# EAGLE design design1 (EAGLE 9.5.1)
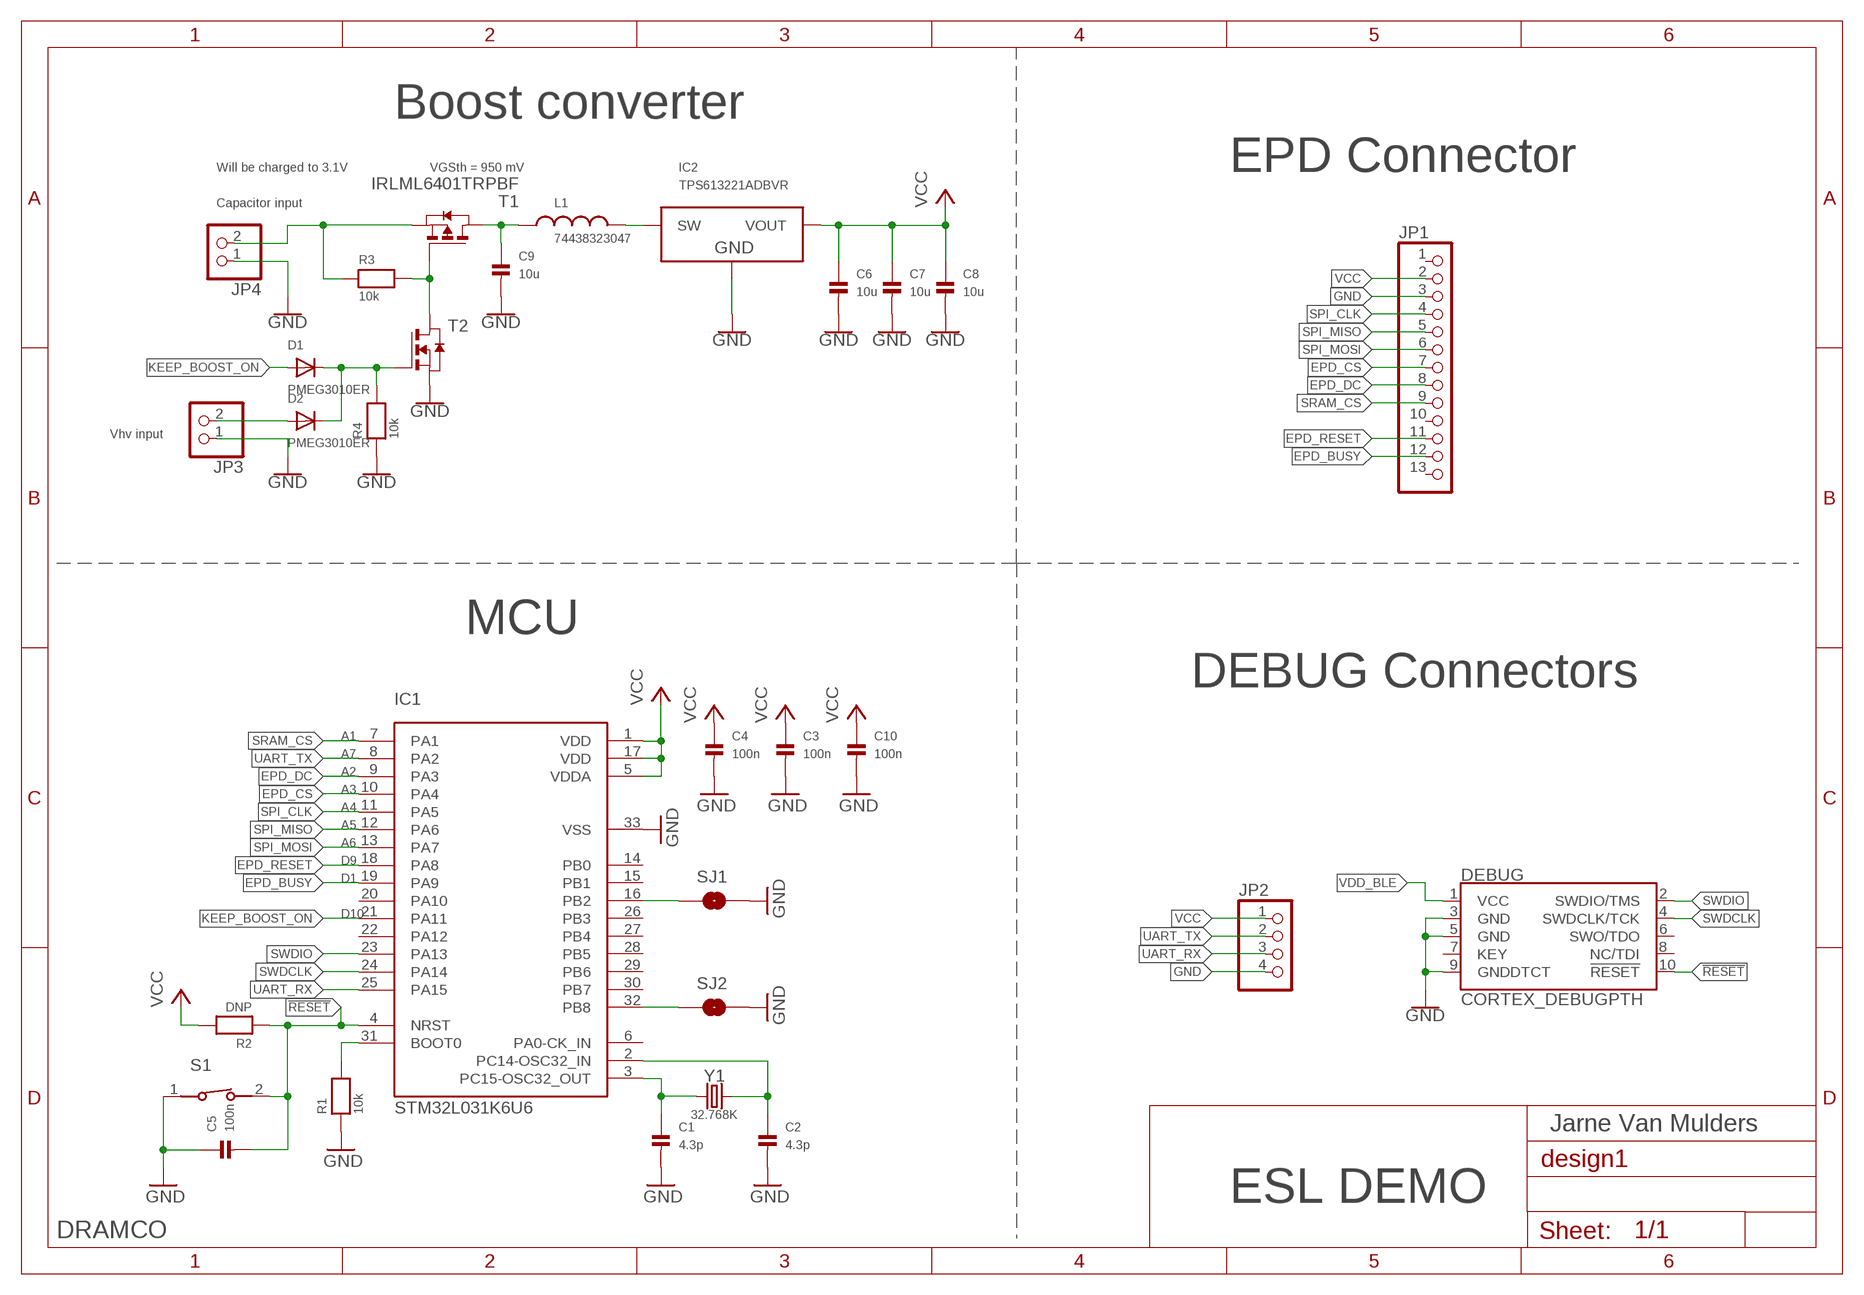
[diagram p0: schematic, sheet 1]

## Parts
C1  4.3p  CAP_CERAMIC0603  [0603]
C2  4.3p  CAP_CERAMIC0603  [0603]
C3  100n  CAP_CERAMIC0603  [0603]
C4  100n  CAP_CERAMIC0603  [0603]
C5  100n  CAP_CERAMIC0603  [0603]
C6  10u  CAP_CERAMIC0805  [0805]
C7  10u  CAP_CERAMIC0805  [0805]
C8  10u  CAP_CERAMIC0805  [0805]
C9  10u  CAP_CERAMIC0805  [0805]
C10  100n  CAP_CERAMIC0603  [0603]
D1  PMEG3010ER  DIODESOD-323  [SOD-323]
D2  PMEG3010ER  DIODESOD-323  [SOD-323]
DEBUG  CORTEX_DEBUGPTH  [2X5-PTH-1.27MM]
IC1  STM32L031K6U6  [UFQFPN32]
IC2  TPS61322XX  [SOT95P280X145-5N]
JP1  HEADER-1X13  [1X13_ROUND_70]
JP2  HEADER-1X4ROUND  [1X04_ROUND]
JP3  HEADER-1X2ROUND  [1X02_ROUND]
JP4  HEADER-1X2ROUND  [1X02_ROUND]
L1  74438323047  WE-MAPI_2510_74438323047  [WE-MAIA_2510]
R1  10k  RESISTOR0603  [0603]
R2  DNP  RESISTOR0603  [0603]
R3  10k  RESISTOR0603  [0603]
R4  10k  RESISTOR0603  [0603]
S1  434111043826  [434111043826]
SJ1  SOLDERJUMPERNO  [SJ_2S-NO]
SJ2  SOLDERJUMPERNO  [SJ_2S-NO]
T1  IRLML6401TRPBF  PMOSSOT23  [SOT-23]
T2  NMOSSOT23  [SOT-23]
Y1  32.768K  CRYSTALSMD-3.2X1.5  [CRYSTAL-SMD-3.2X1.5MM]

## Nets
!RESET!: C5.2 DEBUG.10(!RESET) IC1.4(NRST) R2.1 S1.2
EPD_BUSY: IC1.19(PA9) JP1.12
EPD_CS: IC1.10(PA4) JP1.7
EPD_DC: IC1.9(PA3) JP1.8
EPD_RESET: IC1.18(PA8) JP1.11
GND: C1.2 C2.2 C3.2 C4.2 C5.1 C6.2 C7.2 C8.2 C9.2 C10.2 DEBUG.3(GND) DEBUG.5(GND) DEBUG.9(GNDDTCT) IC1.33(VSS) IC2.2(GND) JP1.3 JP2.4 JP3.1 JP4.1 R1.1 R4.1 S1.1 SJ1.2 SJ2.2 T2.2(S)
KEEP_BOOST_ON: D1.A IC1.21(PA11)
N$1: IC1.31(BOOT0) R1.2
N$2: C2.1 IC1.2(PC14-OSC32_IN) Y1.P$2
N$3: C1.1 IC1.3(PC15-OSC32_OUT) Y1.P$1
N$4: IC1.16(PB2) SJ1.1
N$5: IC1.32(PB8) SJ2.1
N$6: C9.1 L1.1 T1.1(D)
N$7: IC2.1(SW) L1.2
N$9: D1.C D2.C R4.2 T2.3(G)
N$10: R3.2 T1.3(G) T2.1(D)
N$11: JP4.2 R3.1 T1.2(S)
N$12: D2.A JP3.2
SPI_CLK: IC1.11(PA5) JP1.4
SPI_MISO: IC1.12(PA6) JP1.5
SPI_MOSI: IC1.13(PA7) JP1.6
SRAM_CS: IC1.7(PA1) JP1.9
SWDCLK: DEBUG.4(SWDCLK/TCK) IC1.24(PA14)
SWDIO: DEBUG.2(SWDIO/TMS) IC1.23(PA13)
UART_RX: IC1.25(PA15) JP2.3
UART_TX: IC1.8(PA2) JP2.2
VCC: C3.1 C4.1 C6.1 C7.1 C8.1 C10.1 IC1.1(VDD) IC1.5(VDDA) IC1.17(VDD) IC2.4(VOUT) JP1.2 JP2.1 R2.2
VDD_BLE: DEBUG.1(VCC)
Unconnected: DEBUG.6(SWO/TDO) DEBUG.7(KEY) DEBUG.8(NC/TDI) IC1.6(PA0-CK_IN) IC1.14(PB0) IC1.15(PB1) IC1.20(PA10) IC1.22(PA12) IC1.26(PB3) IC1.27(PB4) IC1.28(PB5) IC1.29(PB6) IC1.30(PB7) JP1.1 JP1.10 JP1.13

## Notes on the sheet
- Boost converter
- Will be charged to 3.1V | VGSth = 950 mV | EPD Connector
- TPS613221ADBVR
- Capacitor input
- Vhv input
- MCU
- DEBUG Connectors
- A1
- A7
- A2
- A3
- A4
- A5
- A6
- D9
- D1
- D10
- Jarne Van Mulders
- ESL DEMO
- DRAMCO

## Library data of the parts
C1-C10 = microbuilder:CAP_CERAMIC: Ceramic Capacitors 0402 - 0402 Surface Mount Capacitors 16pF 50V 5% [Digikey: 445-4899-2-ND] 18pF 50V 5% [Digikey: 490-1281-2-ND] 22pF 50V 5% [Digikey: 490-1283-2-ND] 68pF 50V 5% [Digikey: 490-1289-2-ND] 0.1uF 10V 10% [Digikey: 490-1318-2-ND] 1.0uF 6.3V 10% [Digikey: 490-1320-2-ND] 0603 - 0603 Surface Mount Capacitors 16 pF 50V 5% [Digikey: 445-5051-2-ND] 22 pF 50V [Digikey: PCC220ACVTR-ND] 33 pF 50V 5% [Digikey: 490-1415-1-ND] 56pF 50V 5% [Digikey: 490-1421-1-ND] 220pF 50V 5% [Digikey: 445-1285-1-ND] 680 pF 50V 2200 pF 50V 5% C0G [Digikey: 445-1297-1-ND] 5600 pF 100V 5% X7R [Digikey: 478-3711-1-ND] 0.1 µF 25V 10% [Digikey: PCC2277TR-ND] 0.22 µF 16V 10% X7R [Digikey: 445-1318-1-ND] 1.0 µF 25V 10% [Digikey: 445-5146-2-ND] 0603 - RF Specific 3pF 250V +/-0.1pF RF [Digikey: 712-1347-1-ND] 18 pF 250V 5% [Digikey: 478-3505-1-ND or 712-1322-1-ND] 56 pF 250V 5% C0G RF [Digikey: 490-4867-1-ND] 68 pF 250V RF [Digikey: 490-4868-1-ND] 0805 - 0805 Surface Mount Capacitors 220 pF 250V 2% RF Ceramic Capacitor [Digikey: 712-1398-1-ND] 1000 pF 50V 2% NP0 Ceramic Capacitor [Digikey: 478-3760-1-ND] 0.1 µF 25V 10% Ceramic Capacitor [Digikey: PCC1828TR-ND] 1.0 µF 16V 10% Ceramic Capacitor[Digikey: 490-1691-2-ND] 10.0 µF 10V 10% Ceramic Capacitor[Digikey: 709-1228-1-ND] 10.0 uF 16V 10% Ceramic Capacitor [Digikey: 478-5165-2-ND] 47 uF 6.3V 20% Ceramic Capacitor [Digikey: 587-1779-1-ND or 399-5506-1-ND] 1206 - 1206 Surface Mount Capacitors 47uF 10V 20% Ceramic Capacitor [Digikey: 490-5528-1-ND or 399-5508-1-ND or 445-6010-1-ND] 100uF 6.3V -20%, +80% Y5V Ceramic Capacitor (Digikey: 490-4512-1-ND, Mouser: 81-GRM31CF50J107ZE1L)
D1 D2 = microbuilder:DIODE: Diode SMA Model Volts Amps Type Vf Vr Digikey # Notes SSA34-E3 40V 3A Schottky 480mV @ 3A 200uA @ 40V SSA34-E3/61TGITR-ND CDBA120-G 20V 1A Schottky 500mV @ 1A 500uA @ 20V 641-1014-6-ND REEL MBRA210 10V 2A Schottky 350mV @ 2A 700uA @ 10V MBRA210LT3 SOD-123 Model Volts Amps Type Vf Vr Order # Notes BAT54T1G 30V 200mA Schottky 800mV @ 200mA 2uA @ 25V BAT54T1GOSTR-ND B0530W 30V 500mA Schottky 430mV @ 500mA 130uA @ 30V B0530W-FDICT-ND REEL MBR120 1A 20V Schottky 340mV @ 1A MBR120VLSFT1GOSCT-ND SOD-323 Model Volts Amps Type Vf Vr Order # Notes PMEG2005EJ 20V 500mA Schottky 355mV @ 500mA 568-4110-1-ND ZLLS410 10V 570mA Schottky 380mV @ 570mA ZLLS410CT-ND 1N4148WS 75V 150mA Silicon/Simple 1V 1N4148WSFSCT-ND REEL SOD-523 Model Volts Amps Type Vf Vr Order # Notes BAT54XV2 30V 200mA Schottky 0.8V @ 100mA BAT54XV2CT-ND TB751S 30V 30mA Schottky RB751S-40TE61CT-ND SOT23-R/W (R = Solder Paste/Reflow Ovens, W = Hand-Soldering) Model Volts Amps Type Vf Vr Order # Notes BAT54FILM 40V 300mA Schottky 497-7162-1-ND
DEBUG = SparkFun-Connectors:CORTEX_DEBUG: Cortex Debug Connector Datasheet <http://infocenter.arm.com/help/topic/com.arm.doc.faqs/attached/13634/cortex_debug_connectors.pdf>
IC1 = STM32L031K6U6:STM32L031K6U6: Check availability <https://pricing.snapeda.com/parts/STM32L031K6U6/STMicroelectronics/view-part?ref=eda>; AVAILABILITY: In Stock; CHECK_PRICES: https://www.snapeda.com/parts/STM32L031K6U6/STMicroelectronics/view-part/?ref=eda; DESCRIPTION: ARM® Cortex®-M0+ STM32L0 Microcontroller IC 32-Bit Single-Core 32MHz 32KB (32K x 8) FLASH 32-UFQFPN (5x5); MF: STMicroelectronics; MP: STM32L031K6U6; PACKAGE: UFQFN-32 STMicroelectronics; PRICE: None; SNAPEDA_LINK: https://www.snapeda.com/parts/STM32L031K6U6/STMicroelectronics/view-part/?ref=snap
IC2 = SOT95P280X145-5N:TPS61322XX
JP1 = microbuilder:HEADER-1X13
JP2 = microbuilder:HEADER-1X4: PIN HEADER
JP3 JP4 = microbuilder:HEADER-1X2: PIN HEADER
L1 = PowerMagnetics (rev18e):WE-MAPI_2510: SMD Metal Alloy Power Inductor Characteristics Magnetic iron alloy allows high rated currents Compact design Magnetically shielded High current capability and handles high transient current spikes Low acoustic noise and low leakage flux noise Operating temperature: –40 °C to 125 °C Applications DC/DC-converter for high current power supplies DC/DC-converter for Field Programmable Gate Array (FPGA) POL-converters Portable power like PDA, digital camera Mainboards/graphic cards Battery powered devices Wireless communication devices Power supplies for smartphones, tablet PCs and other mobile devices <http://katalog.we-online.de/media/images/v2/Family_WE-MAPI.jpg> Details see: http://katalog.we-online.de/en/pbs/WE-MAPI? Updated by Dan Xu 2014-07-08 2014 (C) Wurth Elektronik; WE-NUMBER: 74438323047/4,7uH
R1-R4 = microbuilder:RESISTOR: Resistors 0402 - 0402 Surface Mount Package 22 Ohm 1% 1/16W [Digikey: 311-22.0LRTR-ND] 33 Ohm 5% 1/16W 1.0K 5% 1/16W 1.5K 5% 1/16W 2.0K 1% 1/16W 10.0K 1% 1/16W [Digikey: 311-10.0KLRTR-ND] 10.0K 5% 1/16W [Digikey: RMCF0402JT10K0TR-ND] 12.1K 1% 1/16W [Digikey: 311-22.0LRTR-ND] 100.0K 5% 1/16W 0603 - 0603 Surface Mount Package 0 Ohm 1/10 Watt 1% Resistor 15 Ohm 1/10 Watt 1% Resistor 33 Ohm 1/10 Watt 1% Resistor 49.9 Ohm 1/10 Watt 1% Resistor 100 Ohm 1/10 Watt 1% Resistor 150 Ohm 1/10 Watt 1% Resistor 240 Ohm 1/10 Watt 1% Resistor 390 Ohm 1/10 Watt 1% Resistor 560 Ohm 1/10 Watt 1% Resistor 680 Ohm 1/10 Watt 1% Resistor 750 Ohm 1/10 Watt 1% Resistor 1.0K Ohm 1/10 Watt 1% Resistor 1.5K Ohm 1/10 Watt 1% Resistor 2.0K Ohm 1/10 Watt 1% Resistor 2.2K Ohm 1/10 Watt 1% Resistor 3.3K Ohm 1/10 Watt 1% Resistor 4.7K Ohm 1/10 Watt 1% Resistor 10.0K Ohm 1/10 Watt 1% Resistor 12.0K Ohm 1/10 Watt 1% Resistor 12.1K Ohm 1/10 Watt 1% Resistor 20.0K Ohm 1/10 Watt 1% Resistor 33.0K Ohm 1/10 Watt 1% Resistor 100.0K Ohm 1/10 Watt 1% Resistor 0805 - 0805 Surface Mount Package 0 Ohm 1/8 Watt 1% Resistor 33 Ohm 1/8 Watt 1% Resistor 100 Ohm 1/8 Watt 1% Resistor 150 Ohm 1/8 Watt 1% Resistor 200 Ohm 1/8 Watt 1% Resistor 240 Ohm 1/8 Watt 1% Resistor 330 Ohm 1/8 Watt 1% Resistor 390 Ohm 1/8 Watt 1% Resistor 470 Ohm 1/8 Watt 1% Resistor 1.0K Ohm 1/8 Watt 1% Resistor 1.5K Ohm 1/8 Watt 1% Resistor 2.0K Ohm 1/8 Watt 1% Resistor 4.7K Ohm 1/8 Watt 1% Resistor 5.1K Ohm 1/8 Watt 1% Resistor 5.6K Ohm 1/8 Watt 1% Resistor 10.0K Ohm 1/8 Watt 1% Resistor 22.0K Ohm 1/8 Watt 1% Resistor 33.0K Ohm 1/8 Watt 1% Resistor 100K Ohm 1/8 Watt 1% Resistor 1206 - 1206 Surface Mount Package 2012 - 2010 Surface Mount Package 0.11 Ohm 1/2 Watt 1% Resistor - Digikey: RHM.11UCT-ND
S1 = Eagle_SWITCHES (rev18c):434111043826: 6.0x3.5 mm SMD WS-TASV <http://katalog.we-online.de/media/images/v2/Family_WS-TASV_6.0x3.jpg> Details see: http://katalog.we-online.de/em/datasheet/4341x1xxx8x6.pdf 2015 (C) Wurth Elektronik
SJ1 SJ2 = SparkFun-Retired:SOLDERJUMPER: Solder Jumper Standard SMD solder jumper. Used to automate production. Two varients : Normally Open and Normally Closed are the same, but have different paste layers. NC will have a large amount of paste and should jumper during reflow.
T1 = zetex:PMOSSOT23: MOS FET; OC_FARNELL: unknown; OC_NEWARK: unknown
T2 = zetex:NMOSSOT23: MOS FET; OC_FARNELL: unknown; OC_NEWARK: unknown
Y1 = SparkFun-Clocks:CRYSTAL: Crystals (Generic) These are passive quartz crystals, which can be used as a clock source for a microcontroller. Crystal's are two-terminal devices. They require external "load" capacitors to generate an oscillating signal.

## Board
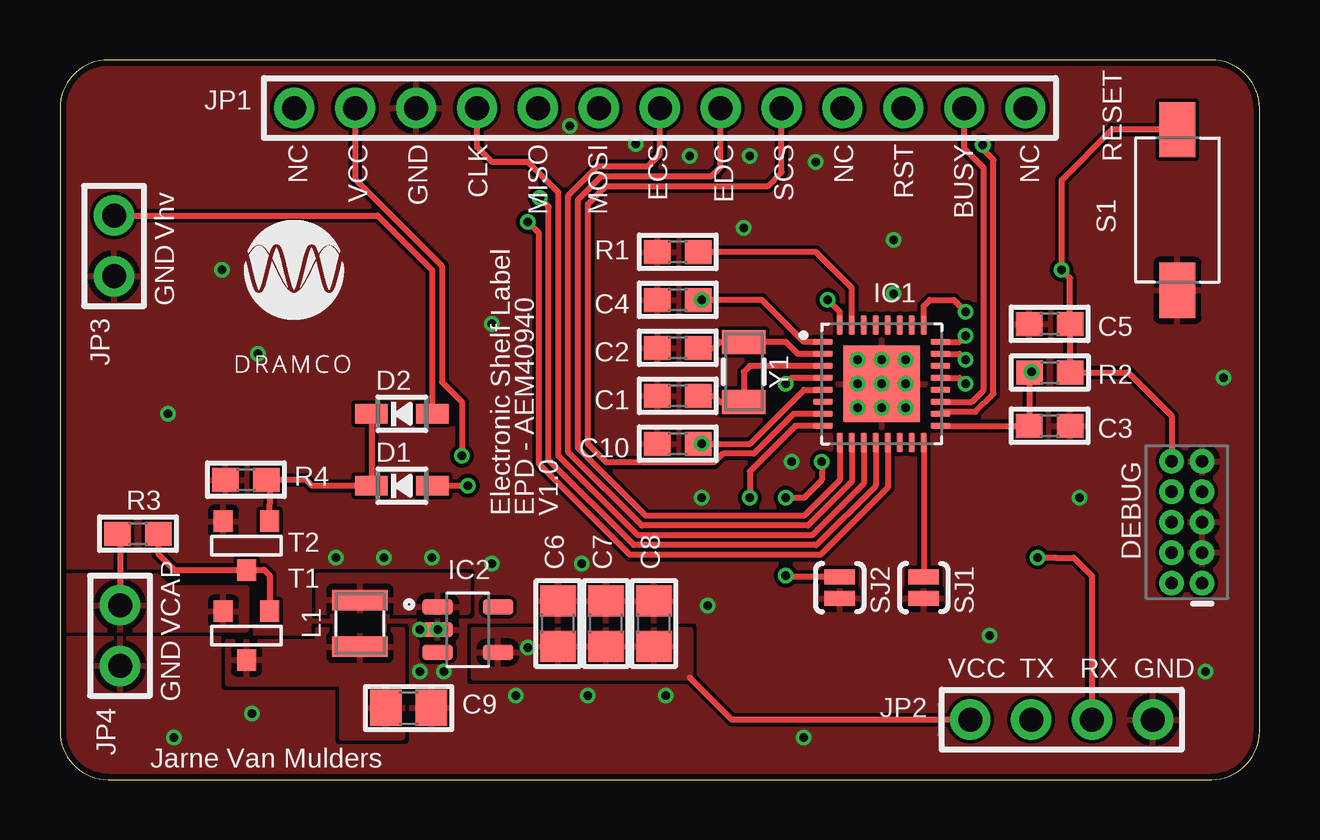
[diagram p1: board, top side]
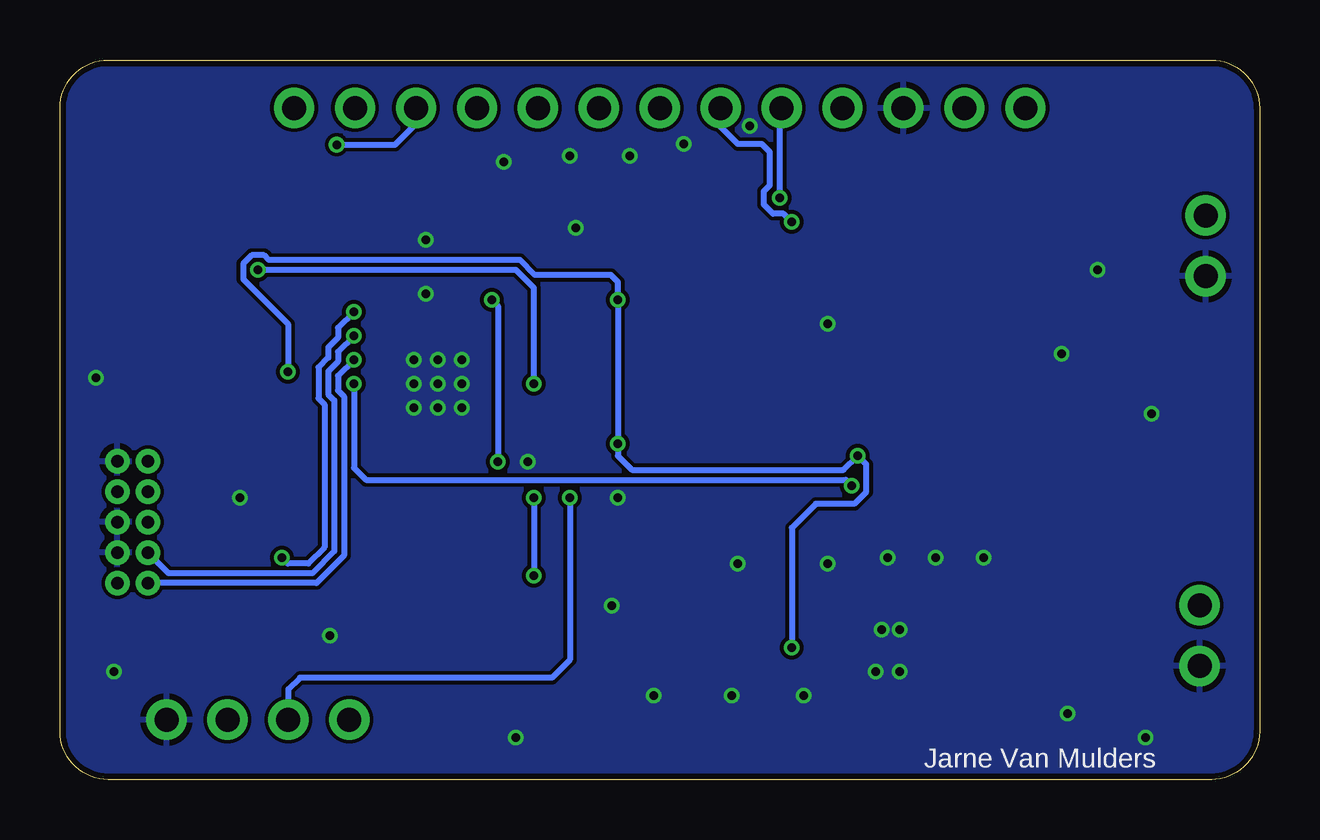
[diagram p2: board, bottom side, seen from below]

Size 50 x 30 mm. Coordinates in mm from the lower left corner, seen from the top.
Outline: 0,28 0,2 arc90 2,0 48,0 arc90 50,2 50,28 arc90 48,30 2,30 arc90 0,28
Copper layers (1*16): Top 0.035mm / dielectric 1.5mm / Bottom 0.035mm
Design rules "SeeedStudio_2layer_DRU_no_angle_20140221-2": minimum track width 6mil, minimum drill 12mil, track to track 6mil, track to pad 6mil, pad to pad 6mil, via to via 6mil, smd to smd 0mil, copper to edge 10mil, drill to drill 10mil, minimum pad ring 10mil, minimum via ring 6mil, stop-mask expansion 2mil, vias tented up to drill 100mil, thermal gap 10mil

### Footprints (pad centres in the part's own frame; a part is rotated, then mirrored left to right if it is on the bottom)
0603 = smd 1.1 x 1: 1 -0.85,0; 2 0.85,0
0805 = smd 1.3 x 1.5: 1 -0.95,0; 2 0.95,0
SOD-323 = smd 1.35 x 0.8: A 1.27,0; C -1.27,0
2X5-PTH-1.27MM = drill 0.508 pad 1: 1 -2.54,-0.635; 2 -2.54,0.635; 3 -1.27,-0.635; 4 -1.27,0.635; 5 0,-0.635; 6 0,0.635; 7 1.27,-0.635; 8 1.27,0.635; 9 2.54,-0.635; 10 2.54,0.635
UFQFPN32 = smd 0.81 x 0.27: 1 -2.45,1.75; 2 -2.45,1.25; 3 -2.45,0.75; 4 -2.45,0.25; 5 -2.45,-0.25; 6 -2.45,-0.75; 7 -2.45,-1.25; 8 -2.45,-1.75; 17 2.45,-1.75; 18 2.45,-1.25; 19 2.45,-0.75; 20 2.45,-0.25; 21 2.45,0.25; 22 2.45,0.75; 23 2.45,1.25; 24 2.45,1.75 | smd 0.27 x 0.81: 9 -1.75,-2.45; 10 -1.25,-2.45; 11 -0.75,-2.45; 12 -0.25,-2.45; 13 0.25,-2.45; 14 0.75,-2.45; 15 1.25,-2.45; 16 1.75,-2.45; 25 1.75,2.45; 26 1.25,2.45; 27 0.75,2.45; 28 0.25,2.45; 29 -0.25,2.45; 30 -0.75,2.45; 31 -1.25,2.45; 32 -1.75,2.45 | smd 3.2 x 3.2: 33 0,0
SOT95P280X145-5N = smd 1.27 x 0.635: 1 -1.255,0.95; 2 -1.255,0; 3 -1.255,-0.95; 4 1.255,-0.95; 5 1.255,0.95
1X13_ROUND_70 = drill 1 pad 1.676: 1 -15.24,0; 2 -12.7,0; 3 -10.16,0; 4 -7.62,0; 5 -5.08,0; 6 -2.54,0; 7 0,0; 8 2.54,0; 9 5.08,0; 10 7.62,0; 11 10.16,0; 12 12.7,0; 13 15.24,0
1X04_ROUND = drill 1 pad 1.676: 1 -3.81,0; 2 -1.27,0; 3 1.27,0; 4 3.81,0
1X02_ROUND = drill 1 pad 1.676: 1 -1.27,0; 2 1.27,0
WE-MAIA_2510 = smd 0.85 x 2.3: 1 -0.975,0; 2 0.975,0
434111043826 = smd 2.3 x 1.5: 1 -3.35,0; 2 3.35,0
SJ_2S-NO = smd 0.635 x 1.27: 1 -0.45,0; 2 0.45,0
SOT-23 = smd 0.787 x 0.889: 1 0.025,-1.016; 2 -0.94,1.016; 3 0.991,1.016
CRYSTAL-SMD-3.2X1.5MM = smd 1 x 1.8: P$1 -1.25,0; P$2 1.25,0

### Placement (x,y rotation side)
C1  25.75,16 180 top
C2  25.75,18 180 top
C3  41.25,14.75 0 top
C4  25.75,20 180 top
C5  41.25,19 0 top
C6  20.75,6.5 90 top
C7  22.75,6.5 90 top
C8  24.75,6.5 90 top
C9  14.53,2.98 0 top
C10  25.75,14 180 top
D1  14.25,12.25 0 top
D2  14.25,15.25 0 top
DEBUG  46.97,10.73 90 top
IC1  34.25,16.5 0 top
IC2  17,6.25 0 top
JP1  25,28 0 top
JP2  41.75,2.5 0 top
JP3  2.25,22.25 90 top
JP4  2.5,6 90 top
L1  12.5,6.51 90 top
R1  25.75,22 0 top
R2  41.26,16.97 180 top
R3  3.25,10.25 0 top
R4  7.75,12.5 0 top
S1  46.58,23.75 90 top
SJ1  36,8 270 top
SJ2  32.5,8 270 top
T1  7.75,6 0 top
T2  7.75,9.75 0 top
Y1  28.5,17 90 top

### Tracks (layer width: path | path; a pad name or v marks a point on that pad's centre or on a via)
!RESET!  (via drill 0.35)
  Top 0.254: S1.2 43.85,27.1 41.75,25 v41.75,21.25 42.1,20.9 C5.2 R2.1 44.53,16.97 46.34,15.16 DEBUG.10 | IC1.4 30.5,16.75 v30.25,16.5
  Bottom 0.254: v30.25,16.5 30.25,20.5 31,21.25 v41.75,21.25
EPD_BUSY
  Top 0.254: IC1.19 38,15.75 38.5,16.25 38.5,25.5 37.7,26.3 JP1.12
EPD_CS
  Top 0.254: IC1.10 33,12.43 31.17,10.59 24.26,10.59 21.19,13.66 21.19,24.34 22.41,25.56 24.5,25.56 25,26.06 JP1.7
EPD_DC
  Top 0.254: IC1.9 32.5,12.5 31,11 24.43,11 21.59,13.83 21.59,24.17 22.58,25.16 27.16,25.16 27.54,25.54 JP1.8
EPD_RESET  (via drill 0.35)
  Top 0.254: IC1.18 36.79,15.34 38.16,15.34 38.91,16.08 38.91,25.84 38.5,26.25 38.5,26.43 v38.47,26.46
  Bottom 0.254: v38.47,26.46 36.03,26.46 35.16,27.34 JP1.11
GND  (via drill 0.35)
  other vias: 34.25,16.5 34.25,17.5 34.25,15.5 33.25,15.5 33.25,16.5 33.25,17.5 35.25,17.5 35.25,16.5 35.25,15.5 28.75,26 31.5,25.75 30.5,13.25 26.75,11.75 26.25,26 24,26.5 21.25,27.25 34.75,20.25 34.75,22.5 11.5,9.25 13.5,9.25 15.5,9.25 18,9 15,6.25 15.75,6.25 15,4.5 16,4.5 19,3.5 22,3.5 25.25,3.5 27,7.25 21.75,9 8,2.75 4.75,1.75 4.5,15.25 8.25,17.75 6.75,21.25 18,19 28.5,23 42.5,11.75 48.5,16.75 47.75,4.5 38.75,6 31,1.75
  pour Top (rank 6): -3.75,33.5 54,33.5 54,-4 -3.75,-4
  pour Bottom: -2.75,34.25 53.75,34.25 53.75,-4 -2.75,-4
KEEP_BOOST_ON  (via drill 0.35)
  Top 0.254: IC1.21 37.5,16.75 v37.75,16.5 | v17,12.25 D1.A
  Bottom 0.254: v37.75,16.5 37.75,13 37.25,12.5 17.25,12.5 v17,12.25
N$1
  Top 0.254: IC1.31 33,20.5 31.5,22 R1.2
N$2
  Top 0.254: C2.1 27.25,18 27.5,18.25 Y1.P$2 30.25,18.25 30.75,17.75 IC1.2
N$3
  Top 0.254: C1.1 27.25,16 27.5,15.75 Y1.P$1 28.5,17 28.75,17.25 IC1.3
N$4
  Top 0.254: IC1.16 SJ1.1
N$5  (via drill 0.35)
  Top 0.254: IC1.32 32.5,19.5 v32,20 | v31.75,13.25 31.75,12.5 31,11.75 v30.25,11.75 | SJ2.1 30.3,8.45 v30.25,8.5
  Bottom 0.254: v31.75,13.25 31.75,19.75 v32,20 | v30.25,11.75 v30.25,8.5
N$6
  pour Top: 10.75,6.25 14.25,6.25 14.25,1.75 11.75,1.75 11.75,4 7,4 7,5.75 10.75,5.75
N$7
  pour Top: 10.75,7 17,7 17,8.5 10.75,8.5
N$9
  Top 0.254: D2.C D1.C 10.5,12.25 10.25,12.5 R4.2 8.75,12.35 8.75,11.5 8.74,11.49 T2.3
N$10
  Top 0.254: T1.3 8.74,8.51 8.5,8.75 7.79,8.75 T2.1 4.77,8.73 4.1,9.4 R3.2
N$11
  Top 0.254: R3.1 2.5,10.15 JP4.2
  pour Top: -0.25,8.5 4,8.5 4.5,8 7.75,8 7.75,6.25 -0.25,6.25
N$12
  Top 0.254: JP3.2 13.23,23.52 15.52,21.23 D2.A
SPI_CLK
  Top 0.254: IC1.11 33.5,12.35 31.34,10.19 24.09,10.19 20.78,13.49 20.78,24.47 19.5,25.75 18,25.75 17.38,26.37 JP1.4
SPI_MISO  (via drill 0.35)
  Top 0.254: IC1.12 34,12.25 31.53,9.78 23.92,9.78 20.37,13.33 20.37,23.88 v20,24.25
  Bottom 0.254: v20,24.25 20,27.92 JP1.5
SPI_MOSI  (via drill 0.35)
  Top 0.254: IC1.13 34.5,12.18 31.7,9.37 23.75,9.37 19.97,13.16 19.97,22.78 v19.5,23.25
  Bottom 0.254: v19.5,23.25 19.84,23.59 20.27,23.59 20.66,23.98 20.66,24.52 20.41,24.77 20.41,26.16 20.75,26.5 21.75,26.5 22.46,27.21 JP1.6
SRAM_CS
  Top 0.254: JP1.9 30.08,25.33 29.5,24.75 22.75,24.75 22,24 22,14 22.78,13.22 27.27,13.22 27.64,13.59 28.92,13.59 30.57,15.25 IC1.7
SWDCLK  (via drill 0.35)
  Top 0.254: v37.75,18.5 37.5,18.25 IC1.24
  Bottom 0.254: v37.75,18.5 38.41,17.84 38.41,17.42 38.81,17.01 38.81,16.06 38.56,15.81 38.56,9.51 39.48,8.6 45.47,8.6 DEBUG.4
SWDIO  (via drill 0.35)
  Top 0.254: IC1.23 37.5,17.75 v37.75,17.5
  Bottom 0.254: v37.75,17.5 38.41,16.84 38.41,16.23 38.16,15.98 38.16,9.34 39.31,8.19 DEBUG.2
UART_RX  (via drill 0.35)
  Top 0.254: IC1.25 36,19.75 36.25,20 37.25,20 v37.75,19.5 | v40.75,9.25 41.5,9.25 42.25,9.25 43.02,8.48 JP2.3
  Bottom 0.254: v37.75,19.5 38.41,18.84 38.41,18.42 38.81,18.01 38.81,17.59 39.22,17.18 39.22,15.89 38.97,15.64 38.97,9.68 39.65,9 40.5,9 v40.75,9.25
UART_TX  (via drill 0.35)
  Top 0.254: IC1.8 30.65,14.75 28.75,12.85 v28.75,11.75
  Bottom 0.254: v28.75,11.75 28.75,5 29.5,4.25 40,4.25 40.48,3.77 JP2.2
VCC  (via drill 0.35)
  Top 0.254: C4.1 v26.75,20 29.25,20 31,18.25 IC1.1 | IC1.17 C3.1 40.3,14.85 40.41,14.96 R2.2 40.44,17 v40.5,17 | IC1.5 31,16.25 28.75,14 v26.75,14 C10.1 | JP1.2 12.3,25.02 15.93,21.4 15.93,16.57 16.75,15.75 v16.75,13.5 | JP2.1 28,2.5 26.25,4.25
  Bottom 0.254: v19.5,5.5 19.5,10.5 18.5,11.5 16.89,11.5 16.39,12 16.39,13.14 v16.75,13.5 17.34,12.91 26.16,12.91 26.75,13.5 v26.75,14 v26.75,20 26.75,20.75 27.04,21.04 30.21,21.04 30.83,21.66 41.3,21.66 41.5,21.86 42,21.86 42.36,21.5 42.36,20.86 40.5,19 v40.5,17
  pour Top: 17.25,6.25 26.25,6.25 26.25,4.25 17.25,4.25

### Text on the board
tPlace: NC | VCC | GND | CLK | MISO | MOSI | ECS | EDC | SCS | NC | RST | BUSY | NC | RESET | Vhv | GND | Electronic Shelf Label | EPD - AEM40940 | V1.0 | VCAP | VCC | TX | RX | GND | GND | Jarne Van Mulders
bPlace: Jarne Van Mulders